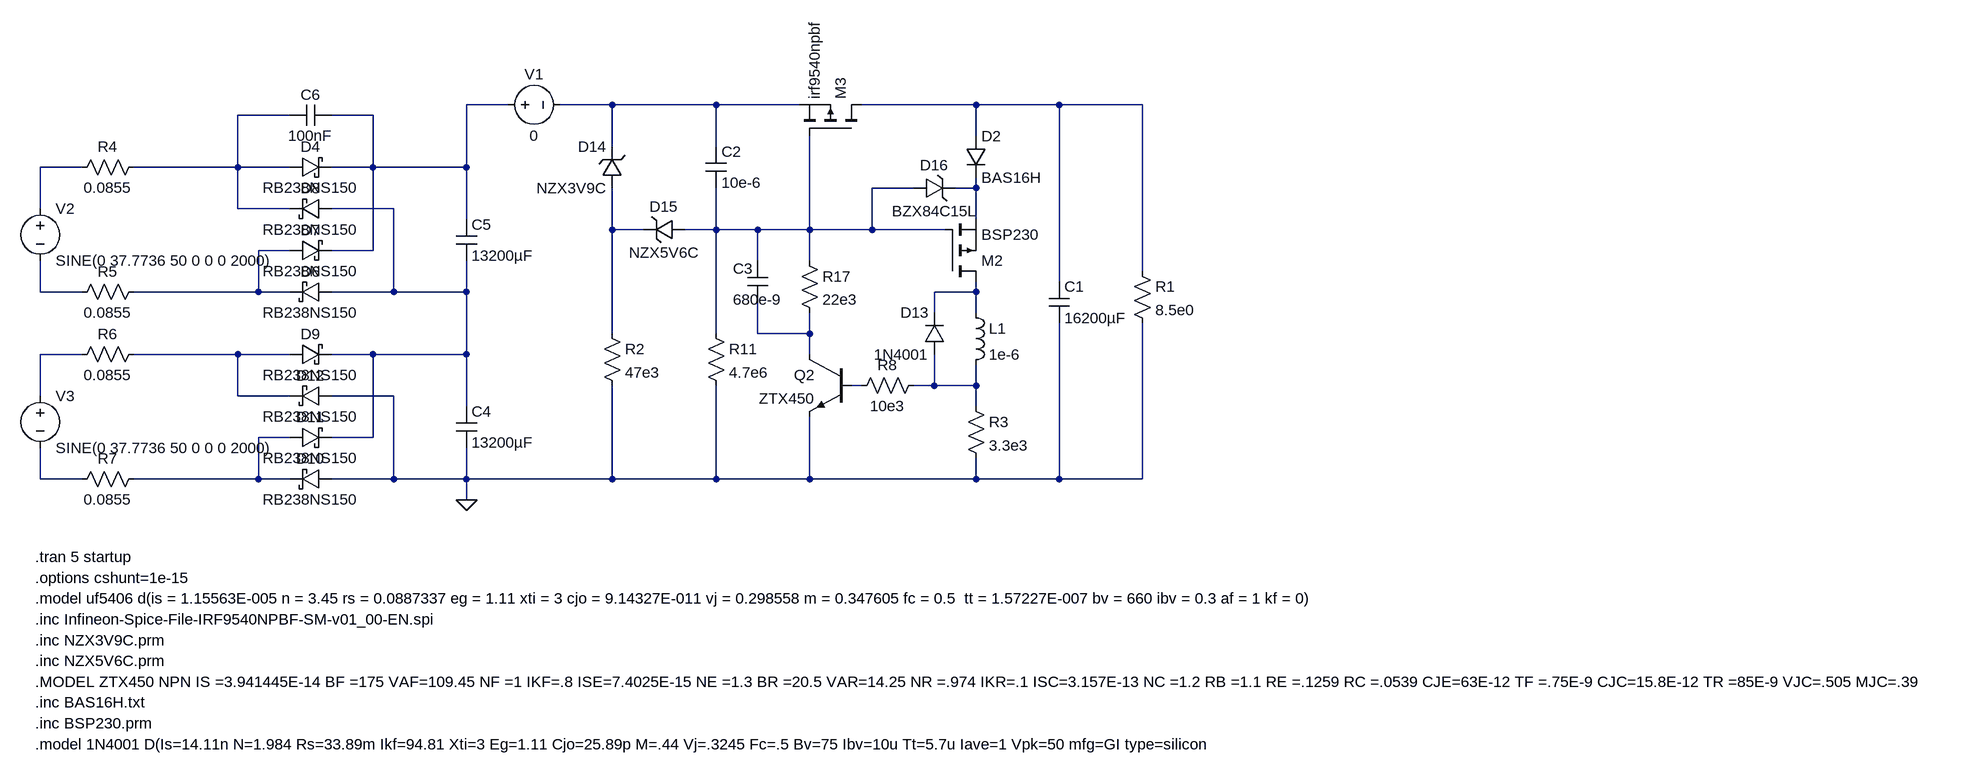
[diagram p0: schematic CapInrush1.asc]
CapInrush1.asc, the LTspice schematic file:
Version 4
SHEET 1 2944 968
WIRE -1456 -192 -1520 -192
WIRE -1296 -192 -1376 -192
WIRE -1136 -192 -1296 -192
WIRE -1008 -192 -1136 -192
WIRE -736 -192 -912 -192
WIRE -608 -192 -736 -192
WIRE -480 -192 -608 -192
WIRE -1792 -176 -1872 -176
WIRE -1664 -176 -1728 -176
WIRE -736 -144 -736 -192
WIRE -1296 -128 -1296 -192
WIRE -1136 -128 -1136 -192
WIRE -2112 -96 -2176 -96
WIRE -1872 -96 -1872 -176
WIRE -1872 -96 -2032 -96
WIRE -1792 -96 -1872 -96
WIRE -1664 -96 -1664 -176
WIRE -1664 -96 -1728 -96
WIRE -1520 -96 -1520 -192
WIRE -1520 -96 -1664 -96
WIRE -832 -64 -896 -64
WIRE -736 -64 -736 -80
WIRE -736 -64 -768 -64
WIRE -2176 -32 -2176 -96
WIRE -1872 -32 -1872 -96
WIRE -1792 -32 -1872 -32
WIRE -1632 -32 -1728 -32
WIRE -1520 -16 -1520 -96
WIRE -736 -16 -736 -64
WIRE -1296 0 -1296 -64
WIRE -1248 0 -1296 0
WIRE -1136 0 -1136 -64
WIRE -1136 0 -1184 0
WIRE -1072 0 -1136 0
WIRE -992 0 -992 -144
WIRE -992 0 -1072 0
WIRE -896 0 -896 -64
WIRE -896 0 -992 0
WIRE -784 0 -896 0
WIRE -1792 32 -1840 32
WIRE -1664 32 -1664 -96
WIRE -1664 32 -1728 32
WIRE -1072 48 -1072 0
WIRE -992 48 -992 0
WIRE -480 64 -480 -192
WIRE -608 80 -608 -192
WIRE -2176 96 -2176 48
WIRE -2112 96 -2176 96
WIRE -1840 96 -1840 32
WIRE -1840 96 -2032 96
WIRE -1792 96 -1840 96
WIRE -1632 96 -1632 -32
WIRE -1632 96 -1728 96
WIRE -1520 96 -1520 48
WIRE -1520 96 -1632 96
WIRE -736 96 -736 80
WIRE -736 96 -800 96
WIRE -800 128 -800 96
WIRE -736 128 -736 96
WIRE -1296 160 -1296 0
WIRE -1136 160 -1136 0
WIRE -1072 160 -1072 112
WIRE -992 160 -992 128
WIRE -992 160 -1072 160
WIRE -2112 192 -2176 192
WIRE -1872 192 -2032 192
WIRE -1792 192 -1872 192
WIRE -1664 192 -1728 192
WIRE -1520 192 -1520 96
WIRE -1520 192 -1664 192
WIRE -992 192 -992 160
WIRE -912 240 -928 240
WIRE -800 240 -800 192
WIRE -800 240 -832 240
WIRE -736 240 -736 208
WIRE -736 240 -800 240
WIRE -2176 256 -2176 192
WIRE -1872 256 -1872 192
WIRE -1792 256 -1872 256
WIRE -1632 256 -1728 256
WIRE -1520 272 -1520 192
WIRE -736 272 -736 240
WIRE -1792 320 -1840 320
WIRE -1664 320 -1664 192
WIRE -1664 320 -1728 320
WIRE -2176 384 -2176 336
WIRE -2112 384 -2176 384
WIRE -1840 384 -1840 320
WIRE -1840 384 -2032 384
WIRE -1792 384 -1840 384
WIRE -1632 384 -1632 256
WIRE -1632 384 -1728 384
WIRE -1520 384 -1520 336
WIRE -1520 384 -1632 384
WIRE -1296 384 -1296 240
WIRE -1296 384 -1520 384
WIRE -1136 384 -1136 240
WIRE -1136 384 -1296 384
WIRE -992 384 -992 288
WIRE -992 384 -1136 384
WIRE -736 384 -736 352
WIRE -736 384 -992 384
WIRE -608 384 -608 144
WIRE -608 384 -736 384
WIRE -480 384 -480 144
WIRE -480 384 -608 384
WIRE -1520 416 -1520 384
FLAG -1520 416 0
SYMBOL voltage -2176 -48 R0
WINDOW 123 0 0 Left 0
WINDOW 39 0 0 Left 0
SYMATTR InstName V2
SYMATTR Value SINE(0 37.7736 50 0 0 0 2000)
SYMBOL schottky -1792 -80 R270
WINDOW 0 32 32 VTop 2
WINDOW 3 0 32 VBottom 2
SYMATTR InstName D4
SYMATTR Value RB238NS150
SYMATTR Description Diode
SYMATTR Type diode
SYMBOL schottky -1728 80 R90
WINDOW 0 0 32 VBottom 2
WINDOW 3 32 32 VTop 2
SYMATTR InstName D6
SYMATTR Value RB238NS150
SYMATTR Description Diode
SYMATTR Type diode
SYMBOL schottky -1792 48 R270
WINDOW 0 32 32 VTop 2
WINDOW 3 0 32 VBottom 2
SYMATTR InstName D7
SYMATTR Value RB238NS150
SYMATTR Description Diode
SYMATTR Type diode
SYMBOL schottky -1728 -48 R90
WINDOW 0 0 32 VBottom 2
WINDOW 3 32 32 VTop 2
SYMATTR InstName D8
SYMATTR Value RB238NS150
SYMATTR Description Diode
SYMATTR Type diode
SYMBOL res -2016 -112 R90
WINDOW 0 0 56 VBottom 2
WINDOW 3 32 56 VTop 2
SYMATTR InstName R4
SYMATTR Value 0.0855
SYMBOL schottky -1792 208 R270
WINDOW 0 32 32 VTop 2
WINDOW 3 0 32 VBottom 2
SYMATTR InstName D9
SYMATTR Value RB238NS150
SYMATTR Description Diode
SYMATTR Type diode
SYMBOL schottky -1728 368 R90
WINDOW 0 0 32 VBottom 2
WINDOW 3 32 32 VTop 2
SYMATTR InstName D10
SYMATTR Value RB238NS150
SYMATTR Description Diode
SYMATTR Type diode
SYMBOL schottky -1792 336 R270
WINDOW 0 32 32 VTop 2
WINDOW 3 0 32 VBottom 2
SYMATTR InstName D11
SYMATTR Value RB238NS150
SYMATTR Description Diode
SYMATTR Type diode
SYMBOL schottky -1728 240 R90
WINDOW 0 0 32 VBottom 2
WINDOW 3 32 32 VTop 2
SYMATTR InstName D12
SYMATTR Value RB238NS150
SYMATTR Description Diode
SYMATTR Type diode
SYMBOL res -2016 80 R90
WINDOW 0 0 56 VBottom 2
WINDOW 3 32 56 VTop 2
SYMATTR InstName R5
SYMATTR Value 0.0855
SYMBOL voltage -2176 240 R0
WINDOW 123 0 0 Left 0
WINDOW 39 0 0 Left 0
SYMATTR InstName V3
SYMATTR Value SINE(0 37.7736 50 0 0 0 2000)
SYMBOL res -2016 176 R90
WINDOW 0 0 56 VBottom 2
WINDOW 3 32 56 VTop 2
SYMATTR InstName R6
SYMATTR Value 0.0855
SYMBOL res -2016 368 R90
WINDOW 0 0 56 VBottom 2
WINDOW 3 32 56 VTop 2
SYMATTR InstName R7
SYMATTR Value 0.0855
SYMBOL cap -1536 272 R0
SYMATTR InstName C4
SYMATTR Value 13200µF
SYMATTR SpiceLine V=50
SYMBOL cap -1536 -16 R0
SYMATTR InstName C5
SYMATTR Value 13200µF
SYMATTR SpiceLine V=50
SYMBOL cap -1728 -192 R90
WINDOW 0 0 32 VBottom 2
WINDOW 3 32 32 VTop 2
SYMATTR InstName C6
SYMATTR Value 100nF
SYMATTR SpiceLine V=60
SYMBOL voltage -1472 -192 R270
WINDOW 0 32 56 VTop 2
WINDOW 3 -32 56 VBottom 2
WINDOW 123 0 0 Left 0
WINDOW 39 0 0 Left 0
SYMATTR InstName V1
SYMATTR Value 0
SYMBOL pmos -912 -144 M270
SYMATTR InstName M3
SYMATTR Value irf9540npbf
SYMATTR Prefix X
SYMBOL cap -624 80 R0
SYMATTR InstName C1
SYMATTR Value 16200µF
SYMATTR SpiceLine V=80
SYMBOL res -1152 144 R0
SYMATTR InstName R11
SYMATTR Value 4.7e6
SYMBOL cap -1152 -128 R0
SYMATTR InstName C2
SYMATTR Value 10e-6
SYMBOL res -496 48 R0
SYMATTR InstName R1
SYMATTR Value 8.5e0
SYMBOL res -1312 144 R0
SYMATTR InstName R2
SYMATTR Value 47e3
SYMBOL res -752 256 R0
SYMATTR InstName R3
SYMATTR Value 3.3e3
SYMBOL pmos -784 80 M180
SYMATTR InstName M2
SYMATTR Value BSP230
SYMATTR Prefix X
SYMBOL res -816 224 R90
WINDOW 0 0 56 VBottom 2
WINDOW 3 32 56 VTop 2
SYMATTR InstName R8
SYMATTR Value 10e3
SYMBOL res -1008 32 R0
SYMATTR InstName R17
SYMATTR Value 22e3
SYMBOL npn -928 192 M0
SYMATTR InstName Q2
SYMATTR Value ZTX450
SYMBOL cap -1088 48 R0
WINDOW 0 -22 12 Left 2
WINDOW 3 -22 60 Left 2
SYMATTR InstName C3
SYMATTR Value 680e-9
SYMBOL diode -752 -144 R0
SYMATTR InstName D2
SYMATTR Value BAS16H
SYMBOL diode -784 192 R180
WINDOW 0 24 64 Left 2
WINDOW 3 24 0 Left 2
SYMATTR InstName D13
SYMATTR Value 1N4001
SYMBOL zener -1280 -64 R180
WINDOW 0 24 64 Left 2
WINDOW 3 24 0 Left 2
SYMATTR InstName D14
SYMATTR Value NZX3V9C
SYMATTR Prefix X
SYMBOL zener -1184 -16 R90
WINDOW 0 -4 32 VBottom 2
WINDOW 3 36 32 VTop 2
SYMATTR InstName D15
SYMATTR Value NZX5V6C
SYMATTR Prefix X
SYMBOL zener -832 -48 R270
WINDOW 0 36 32 VTop 2
WINDOW 3 -4 32 VBottom 2
SYMATTR InstName D16
SYMATTR Value BZX84C15L
SYMBOL ind -752 112 R0
SYMATTR InstName L1
SYMATTR Value 1e-6
SYMATTR SpiceLine Rser=1.6e3
TEXT -2184 504 Left 2 !.tran 5 startup
TEXT -2184 568 Left 2 !.model uf5406 d(is = 1.15563E-005 n = 3.45 rs = 0.0887337 eg = 1.11 xti = 3 cjo = 9.14327E-011 vj = 0.298558 m = 0.347605 fc = 0.5  tt = 1.57227E-007 bv = 660 ibv = 0.3 af = 1 kf = 0)
TEXT -2184 664 Left 2 !.inc NZX5V6C.prm
TEXT -2184 632 Left 2 !.inc NZX3V9C.prm
TEXT -2184 600 Left 2 !.inc Infineon-Spice-File-IRF9540NPBF-SM-v01_00-EN.spi
TEXT -2184 536 Left 2 !.options cshunt=1e-15
TEXT -2184 696 Left 2 !.MODEL ZTX450 NPN IS =3.941445E-14 BF =175 VAF=109.45 NF =1 IKF=.8 ISE=7.4025E-15 NE =1.3 BR =20.5 VAR=14.25 NR =.974 IKR=.1 ISC=3.157E-13 NC =1.2 RB =1.1 RE =.1259 RC =.0539 CJE=63E-12 TF =.75E-9 CJC=15.8E-12 TR =85E-9 VJC=.505 MJC=.39
TEXT -2184 728 Left 2 !.inc BAS16H.txt
TEXT -2184 760 Left 2 !.inc BSP230.prm
TEXT -2184 792 Left 2 !.model 1N4001 D(Is=14.11n N=1.984 Rs=33.89m Ikf=94.81 Xti=3 Eg=1.11 Cjo=25.89p M=.44 Vj=.3245 Fc=.5 Bv=75 Ibv=10u Tt=5.7u Iave=1 Vpk=50 mfg=GI type=silicon

The netlist it stands for:
* CapInrush1.asc
V2 N005 N011 SINE(0 37.7736 50 0 0 0 2000)
D4 N004 N001 RB238NS150
D6 N008 N010 RB238NS150
D7 N010 N001 RB238NS150
D8 N008 N004 RB238NS150
R4 N004 N005 0.0855
D9 N015 N008 RB238NS150
D10 0 N018 RB238NS150
D11 N018 N008 RB238NS150
D12 0 N015 RB238NS150
R5 N010 N011 0.0855
V3 N014 N019 SINE(0 37.7736 50 0 0 0 2000)
R6 N015 N014 0.0855
R7 N018 N019 0.0855
C4 N008 0 13200µF V=50
C5 N001 N008 13200µF V=50
C6 N001 N004 100nF V=60
V1 N001 N002 0
XM3 N003 N006 N002 irf9540npbf  ; pins D G S
C1 N003 0 16200µF V=80
R11 N006 0 4.7e6
C2 N002 N006 10e-6
R1 N003 0 8.5e0
R2 N009 0 47e3
R3 N017 0 3.3e3
XM2 N012 N006 N007 BSP230  ; pins D G S
R8 N017 N016 10e3
R17 N006 N013 22e3
Q2 N013 N016 0 0 ZTX450
C3 N006 N013 680e-9
D2 N003 N007 BAS16H
D13 N017 N012 1N4001
XD14 N009 N002 NZX3V9C  ; pins + -
XD15 N006 N009 NZX5V6C  ; pins + -
D16 N006 N007 BZX84C15L
L1 N012 N017 1e-6 Rser=1.6e3
.model D D
.lib standard.dio
.model NPN NPN
.model PNP PNP
.lib standard.bjt
.tran 5 startup
.model uf5406 d(is = 1.15563E-005 n = 3.45 rs = 0.0887337 eg = 1.11 xti = 3 cjo = 9.14327E-011 vj = 0.298558 m = 0.347605 fc = 0.5  tt = 1.57227E-007 bv = 660 ibv = 0.3 af = 1 kf = 0)
.inc NZX5V6C.prm
.inc NZX3V9C.prm
.inc Infineon-Spice-File-IRF9540NPBF-SM-v01_00-EN.spi
.options cshunt=1e-15
.MODEL ZTX450 NPN IS =3.941445E-14 BF =175 VAF=109.45 NF =1 IKF=.8 ISE=7.4025E-15 NE =1.3 BR =20.5 VAR=14.25 NR =.974 IKR=.1 ISC=3.157E-13 NC =1.2 RB =1.1 RE =.1259 RC =.0539 CJE=63E-12 TF =.75E-9 CJC=15.8E-12 TR =85E-9 VJC=.505 MJC=.39
.inc BAS16H.txt
.inc BSP230.prm
.model 1N4001 D(Is=14.11n N=1.984 Rs=33.89m Ikf=94.81 Xti=3 Eg=1.11 Cjo=25.89p M=.44 Vj=.3245 Fc=.5 Bv=75 Ibv=10u Tt=5.7u Iave=1 Vpk=50 mfg=GI type=silicon
.backanno
.end